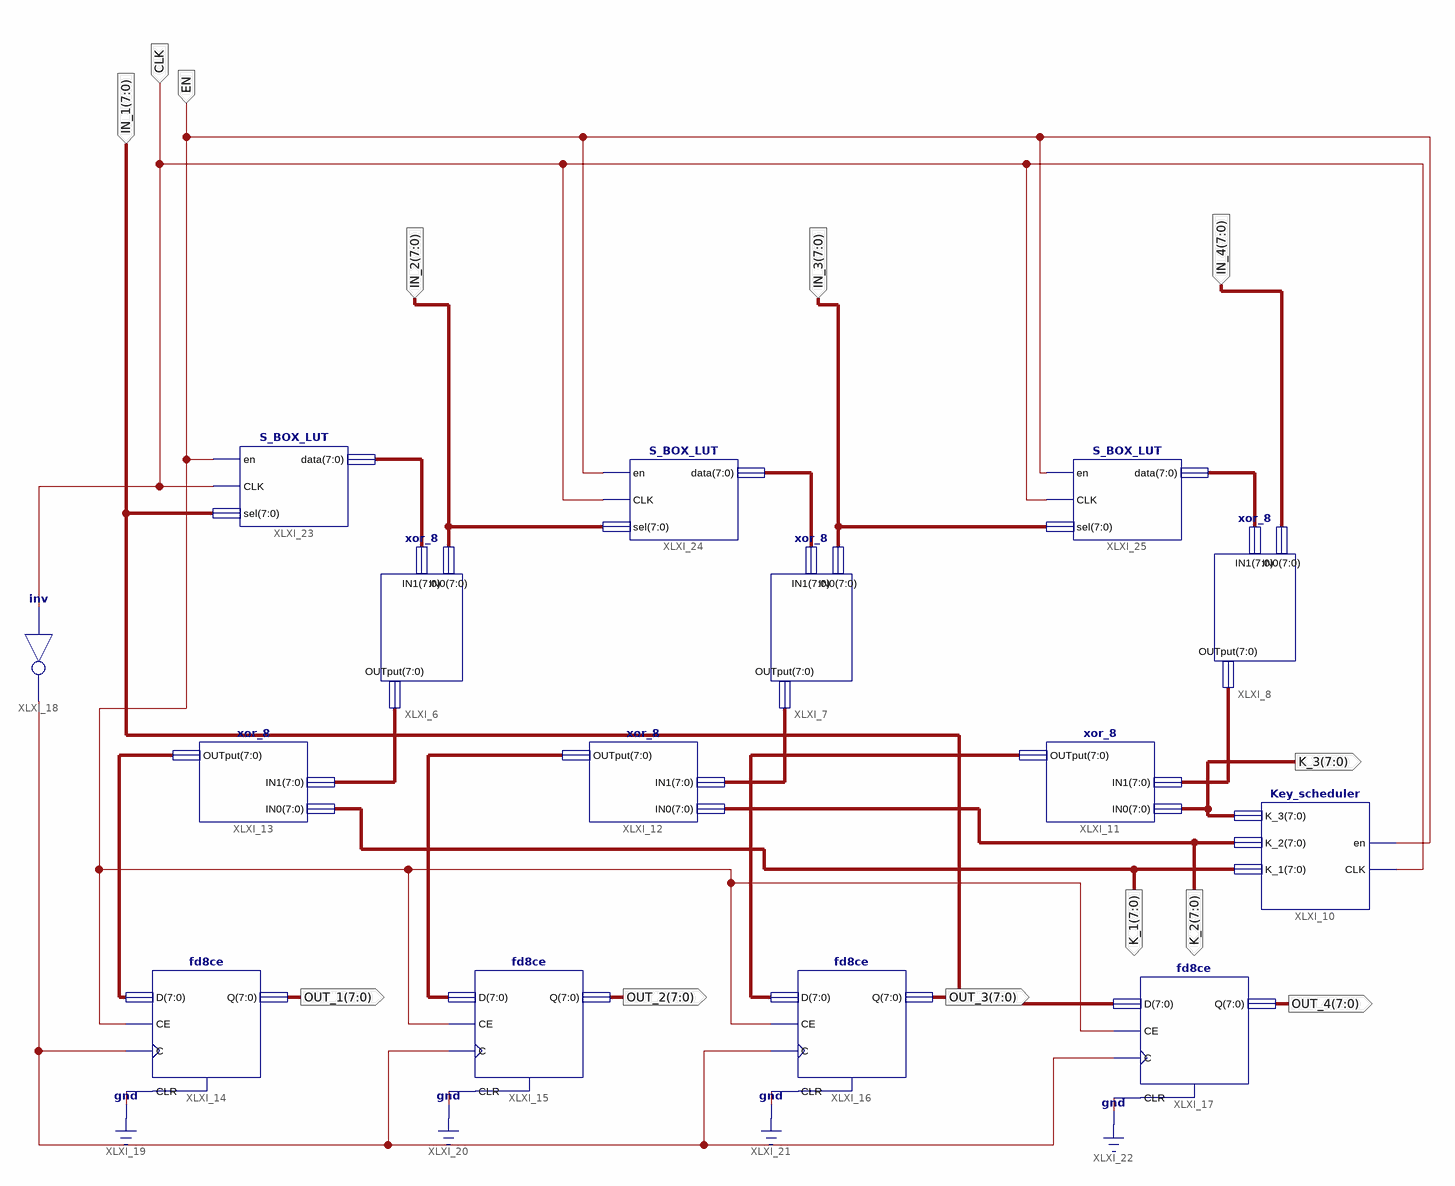
[diagram p0: schematic sheet 1]
// Xilinx ISE schematic Main.sch (spartan6) as structural Verilog: 15 symbols, 13 ports
module Main (
  input  [7:0] IN_1,
  input  EN,
  input  CLK,
  input  [7:0] IN_3,
  input  [7:0] IN_2,
  input  [7:0] IN_4,
  output [7:0] OUT_1,
  output [7:0] OUT_2,
  output [7:0] OUT_3,
  output [7:0] OUT_4,
  output [7:0] K_3,
  output [7:0] K_2,
  output [7:0] K_1
);

  wire XLXN_30;
  wire [7:0] XLXN_21, XLXN_22, XLXN_23, XLXN_24, XLXN_27, XLXN_28, XLXN_39, XLXN_40, XLXN_41;

  xor_8 XLXI_6 (.IN0(IN_2), .IN1(XLXN_22), .OUTput(XLXN_28));
  xor_8 XLXI_7 (.IN0(IN_3), .IN1(XLXN_23), .OUTput(XLXN_27));
  xor_8 XLXI_8 (.IN0(IN_4), .IN1(XLXN_21), .OUTput(XLXN_24));
  Key_scheduler XLXI_10 (.CLK(CLK), .en(EN), .K_1(K_1), .K_2(K_2), .K_3(K_3));
  xor_8 XLXI_11 (.IN0(K_3), .IN1(XLXN_24), .OUTput(XLXN_41));
  xor_8 XLXI_12 (.IN0(K_2), .IN1(XLXN_27), .OUTput(XLXN_40));
  xor_8 XLXI_13 (.IN0(K_1), .IN1(XLXN_28), .OUTput(XLXN_39));
  fd8ce XLXI_14 (.C(XLXN_30), .CE(EN), .CLR(1'b0), .D(XLXN_39), .Q(OUT_1));
  fd8ce XLXI_15 (.C(XLXN_30), .CE(EN), .CLR(1'b0), .D(XLXN_40), .Q(OUT_2));
  fd8ce XLXI_16 (.C(XLXN_30), .CE(EN), .CLR(1'b0), .D(XLXN_41), .Q(OUT_3));
  fd8ce XLXI_17 (.C(XLXN_30), .CE(EN), .CLR(1'b0), .D(IN_1), .Q(OUT_4));
  not XLXI_18 (XLXN_30, CLK);
  S_BOX_LUT XLXI_23 (.en(EN), .CLK(CLK), .sel(IN_1), .data(XLXN_22));
  S_BOX_LUT XLXI_24 (.en(EN), .CLK(CLK), .sel(IN_2), .data(XLXN_23));
  S_BOX_LUT XLXI_25 (.en(EN), .CLK(CLK), .sel(IN_3), .data(XLXN_21));
endmodule
